# Altium schematic sheet Sheet1.SchDoc: Extension PSoC
size A4; DrawnBy: M. Osée; Revision: B; SheetNumber: 1; SheetTotal: 2
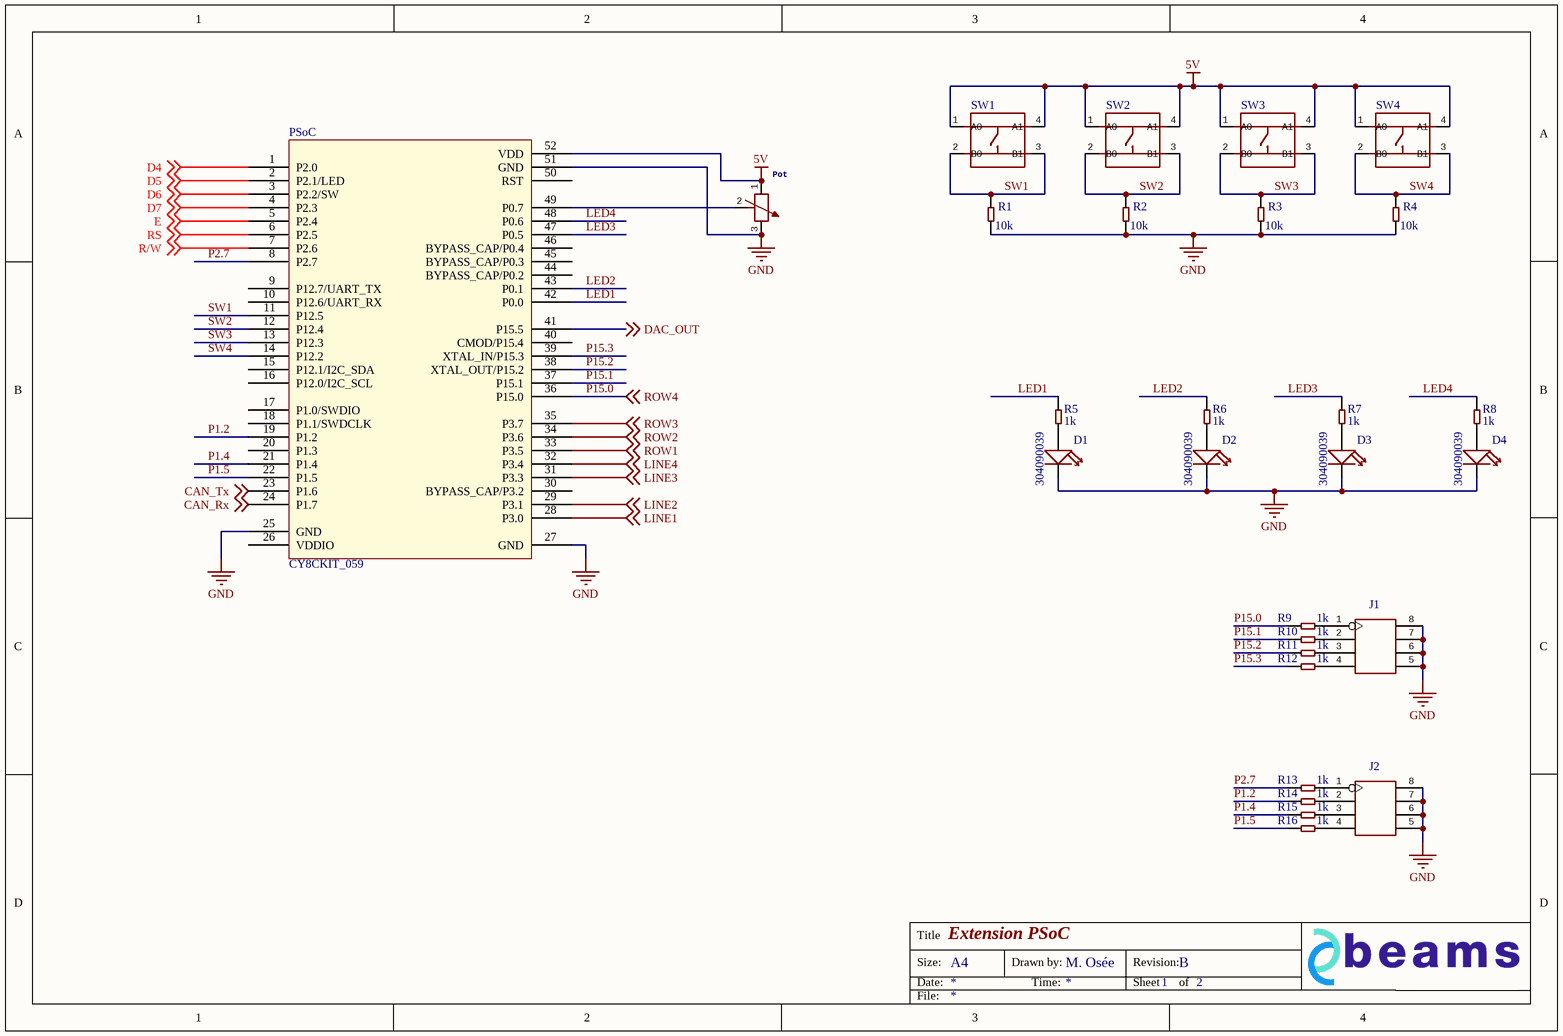
[diagram p0: Sheet1.SchDoc]

## Parts
D1  304090039  [LED-0805]
D2  304090039  [LED-0805]
D3  304090039  [LED-0805]
D4  304090039  [LED-0805]
J1  320030087  [H2X4-2.54]  (value not drawn)
J2  320030087  [H2X4-2.54]  (value not drawn)
Pot  301040022  [ADJR2+3P-11.0X9.8X12.0MM]  (value not drawn)
PSoC  CY8CKIT_059  [CY8CKIT-059]
R1  value 10k  [R0805]  (hidden comment: 301010361)
R2  value 10k  [R0805]  (hidden comment: 301010361)
R3  value 10k  [R0805]  (hidden comment: 301010361)
R4  value 10k  [R0805]  (hidden comment: 301010361)
R5  value 1k  [R0603]  (hidden comment: 301010298)
R6  value 1k  [R0603]  (hidden comment: 301010298)
R7  value 1k  [R0603]  (hidden comment: 301010298)
R8  value 1k  [R0603]  (hidden comment: 301010298)
R9  value 1k  [R0603]  (hidden comment: 301010298)
R10  value 1k  [R0603]  (hidden comment: 301010298)
R11  value 1k  [R0603]  (hidden comment: 301010298)
R12  value 1k  [R0603]  (hidden comment: 301010298)
R13  value 1k  [R0603]  (hidden comment: 301010298)
R14  value 1k  [R0603]  (hidden comment: 301010298)
R15  value 1k  [R0603]  (hidden comment: 301010298)
R16  value 1k  [R0603]  (hidden comment: 301010298)
SW1  311020024  [SW4-6.0X6.0X5.0MM]  (value not drawn)
SW2  311020024  [SW4-6.0X6.0X5.0MM]  (value not drawn)
SW3  311020024  [SW4-6.0X6.0X5.0MM]  (value not drawn)
SW4  311020024  [SW4-6.0X6.0X5.0MM]  (value not drawn)

## Nets
5V: Pot.1 PSoC.52(VDD) SW1.1(A0) SW1.4(A1) SW2.1(A0) SW2.4(A1) SW3.1(A0) SW3.4(A1) SW4.1(A0) SW4.4(A1)
GND: D1.- D2.- D3.- D4.- J1.5 J1.6 J1.7 J1.8 J2.5 J2.6 J2.7 J2.8 Pot.3 Pot.P1 Pot.P2 PSoC.25(GND) PSoC.27(GND) PSoC.51(GND) R1.1 R2.1 R3.1 R4.1
CAN_Rx: PSoC.24(P1.7) ; off-sheet CAN_Rx
CAN_Tx: PSoC.23(P1.6) ; off-sheet CAN_Tx
D4: PSoC.1(P2.0) ; off-sheet D4
D5: PSoC.2(P2.1/LED) ; off-sheet D5
D6: PSoC.3(P2.2/SW) ; off-sheet D6
D7: PSoC.4(P2.3) ; off-sheet D7
DAC_OUT: PSoC.41(P15.5) ; off-sheet DAC_OUT
E: PSoC.5(P2.4) ; off-sheet E
LED1: PSoC.42(P0.0) R5.2
LED2: PSoC.43(P0.1) R6.2
LED3: PSoC.47(P0.5) R7.2
LED4: PSoC.48(P0.6) R8.2
LINE1: PSoC.28(P3.0) ; off-sheet LINE1
LINE2: PSoC.29(P3.1) ; off-sheet LINE2
LINE3: PSoC.31(P3.3) ; off-sheet LINE3
LINE4: PSoC.32(P3.4) ; off-sheet LINE4
P1.2: PSoC.19(P1.2) R14.2
P1.4: PSoC.21(P1.4) R15.2
P1.5: PSoC.22(P1.5) R16.2
P2.7: PSoC.8(P2.7) R13.2
P15.0: PSoC.36(P15.0) R9.2 ; off-sheet ROW4  [also labelled ROW4]
P15.1: PSoC.37(P15.1) R10.2
P15.2: PSoC.38(XTAL_OUT/P15.2) R11.2
P15.3: PSoC.39(XTAL_IN/P15.3) R12.2
R/W: PSoC.7(P2.6) ; off-sheet R/W
ROW1: PSoC.33(P3.5) ; off-sheet ROW1
ROW2: PSoC.34(P3.6) ; off-sheet ROW2
ROW3: PSoC.35(P3.7) ; off-sheet ROW3
RS: PSoC.6(P2.5) ; off-sheet RS
SW1: PSoC.11(P12.5) R1.2 SW1.2(B0) SW1.3(B1)
SW2: PSoC.12(P12.4) R2.2 SW2.2(B0) SW2.3(B1)
SW3: PSoC.13(P12.3) R3.2 SW3.2(B0) SW3.3(B1)
SW4: PSoC.14(P12.2) R4.2 SW4.2(B0) SW4.3(B1)
NetD1_+: D1.+ R5.1
NetD2_+: D2.+ R6.1
NetD3_+: D3.+ R7.1
NetD4_+: D4.+ R8.1
NetJ1_1: J1.1 R9.1
NetJ1_2: J1.2 R10.1
NetJ1_3: J1.3 R11.1
NetJ1_4: J1.4 R12.1
NetJ2_1: J2.1 R13.1
NetJ2_2: J2.2 R14.1
NetJ2_3: J2.3 R15.1
NetJ2_4: J2.4 R16.1
NetPot_2: Pot.2 PSoC.49(P0.7)

Not connected (* = marked no-connect by the designer): PSoC 9(P12.7/UART_TX) 10(P12.6/UART_RX) 15(P12.1/I2C_SDA) 16(P12.0/I2C_SCL) 17(P1.0/SWDIO) 18(P1.1/SWDCLK) 20(P1.3) 26(VDDIO) 30(BYPASS_CAP/P3.2) 40(CMOD/P15.4) 44(BYPASS_CAP/P0.2) 45(BYPASS_CAP/P0.3) 46(BYPASS_CAP/P0.4) 50(RST)

## Notes on the sheet
- Title
- Size:
- Date:
- A4
- Drawn by:
- Time:
- Revision:
- Sheet
- of
- File:

## Library data of the parts
D1-D4 = SMD-LED-CLEAR-YELLOW(0805): MPN: 17-215UYC/S530-A3/TR8
J1 J2 = DIP-BLACK-FEMALE-HEADER(2X4P-2.54)
Pot = DIP-VR-TOP-ADJ-10K(3+2P-11.0X9.8X12.0MM): MPN: WH09-2-103
PSoC = CY8CKIT-059: Published: 24-Mar-1999; LatestRevisionDate: 29-May-2009; Publisher: Altium Limited
R1-R4 = SMD-RES-10K-1%-1/8W(0805): MPN: RC0805FR-0710KL
R5-R16 = SMD-RES-1K-1%-1/10W(0603): MPN: RC0603FR-071KL
SW1-SW4 = DIP-SWITCH-TACTILE-SPST-NO/TS-1109(4P-D6.0MM)'TS-1109'